# Altium project Relay.PrjPCB
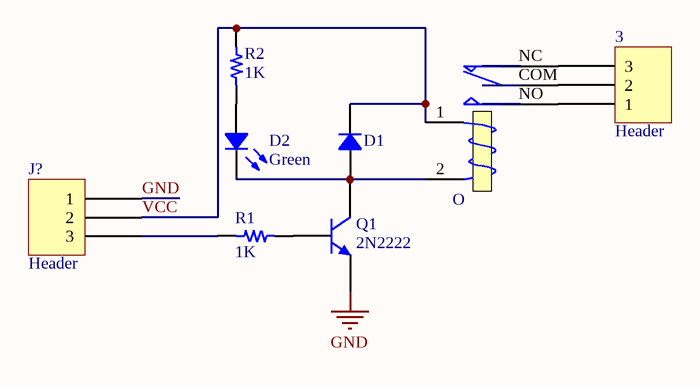
[diagram p0: Relay.SchDoc]
1 sheet, 8 parts. Net scope: global (net labels, ports and power ports of the same name join across sheets).
Board file: Relay.PcbDoc

## Sheet Relay.SchDoc
size A

### Parts
3  Header  [MOLEX KK 0022272031]
D1  (no value)  [SOD123F]
D2  Green  [LED 1206/3216 RED]
J?  Header  [JST XH B3B-XH-A - RIGHT]
O  12V SMALL  [Relay_5_Small]  (value not drawn)
Q1  2N2222  [T4-TO92]
R1  1K  [RES 1206/3216]
R2  1K  [RES 1206/3216]

### Nets
GND: J?.1 Q1.E
VCC: D1.2 J?.2 O.1 R2.1
Net3_1: 3.1 O.NO
Net3_2: 3.2 O.COM
Net3_3: 3.3 O.NC
NetD1_1: D1.1 D2.2 O.2 Q1.C
NetD2_1: D2.1 R2.2
NetJ?_3: J?.3 R1.2
NetQ1_B: Q1.B R1.1

### Library data of the parts
3 J? = 3 Pin
D1 = Diode: Rectifier Diode
D2 = LED: Chip LED; Value: Green
O = Small Relay: Manufacturer: TIANBO; Manufacture Part #: HJR-78F-12VDC-S-Z; Rating: 7A, 120VAC; Link to Datasheet: *; Link to Picture: *; Operating Temp: -40°C to +85°C; Storage Temp: -40°C to +105°C; Tolerance: *; ComponentLink1Description: *; ComponentLink1URL: *; Value: 12V SMALL
Q1 = 2N2222: NPN; E-mail: picpars@gmail.com; De: Seyed Mohsen Ghasemian; web: www.picpars.com
R1 R2 = Resistor: SMT Resistor; Value: 1K